# EAGLE board zx80 SD_12 (smd) build002-001 (EAGLE 9.6.2), part 1 of 2
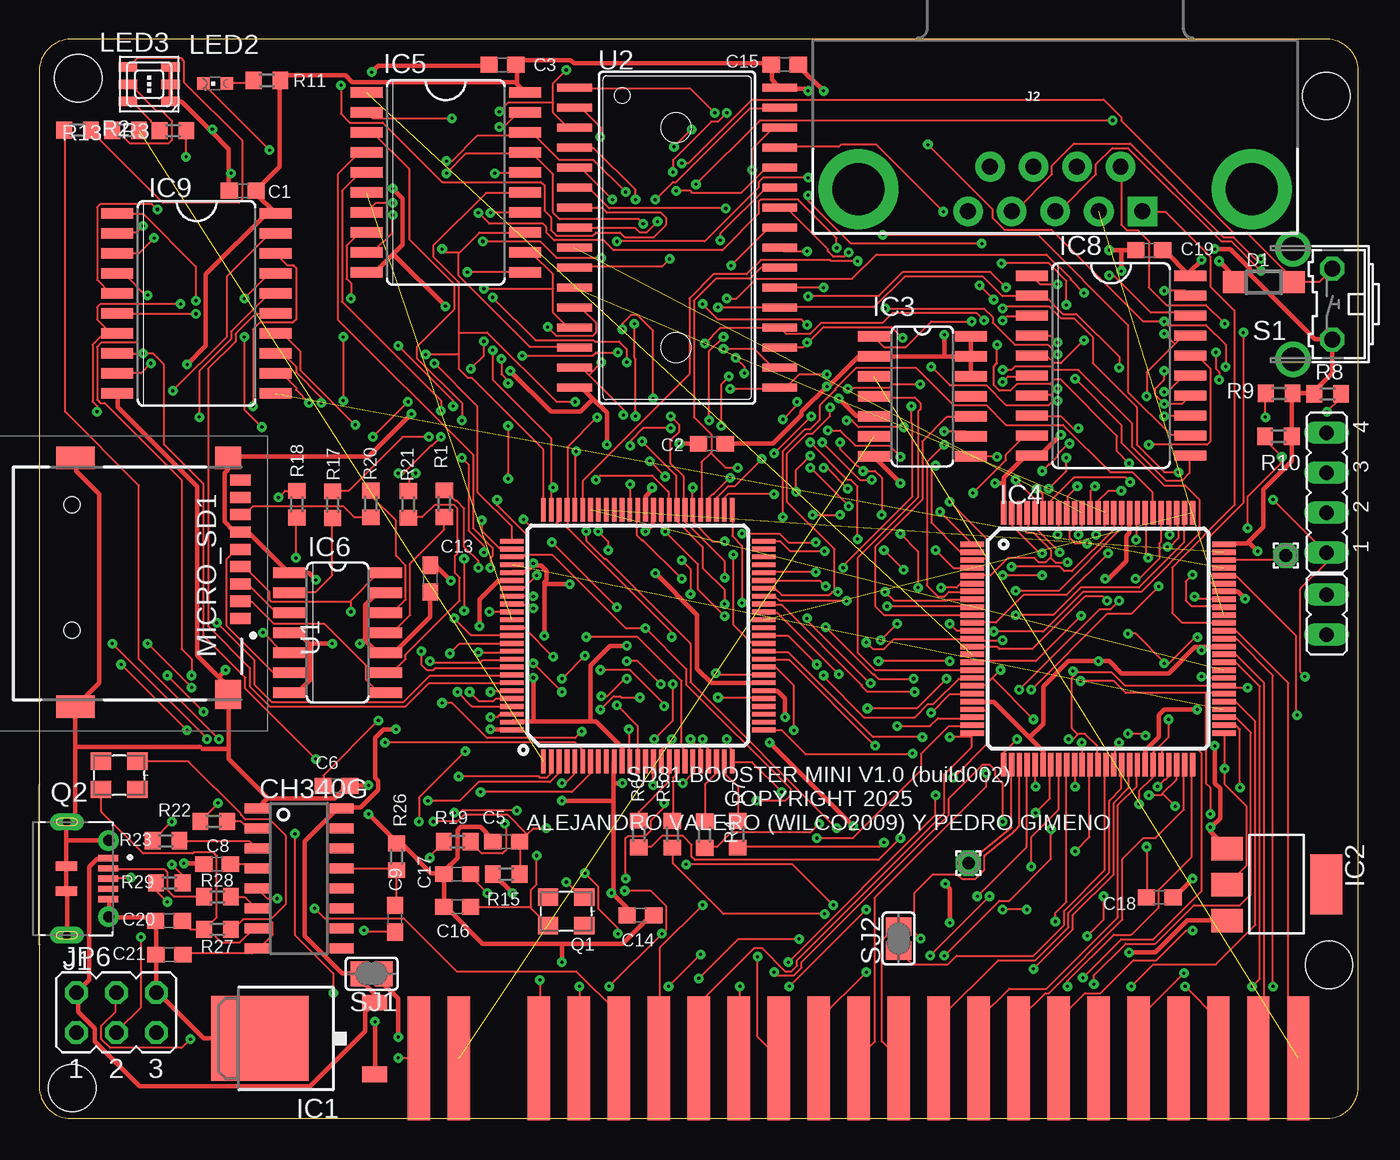
[diagram p2: board, top side]
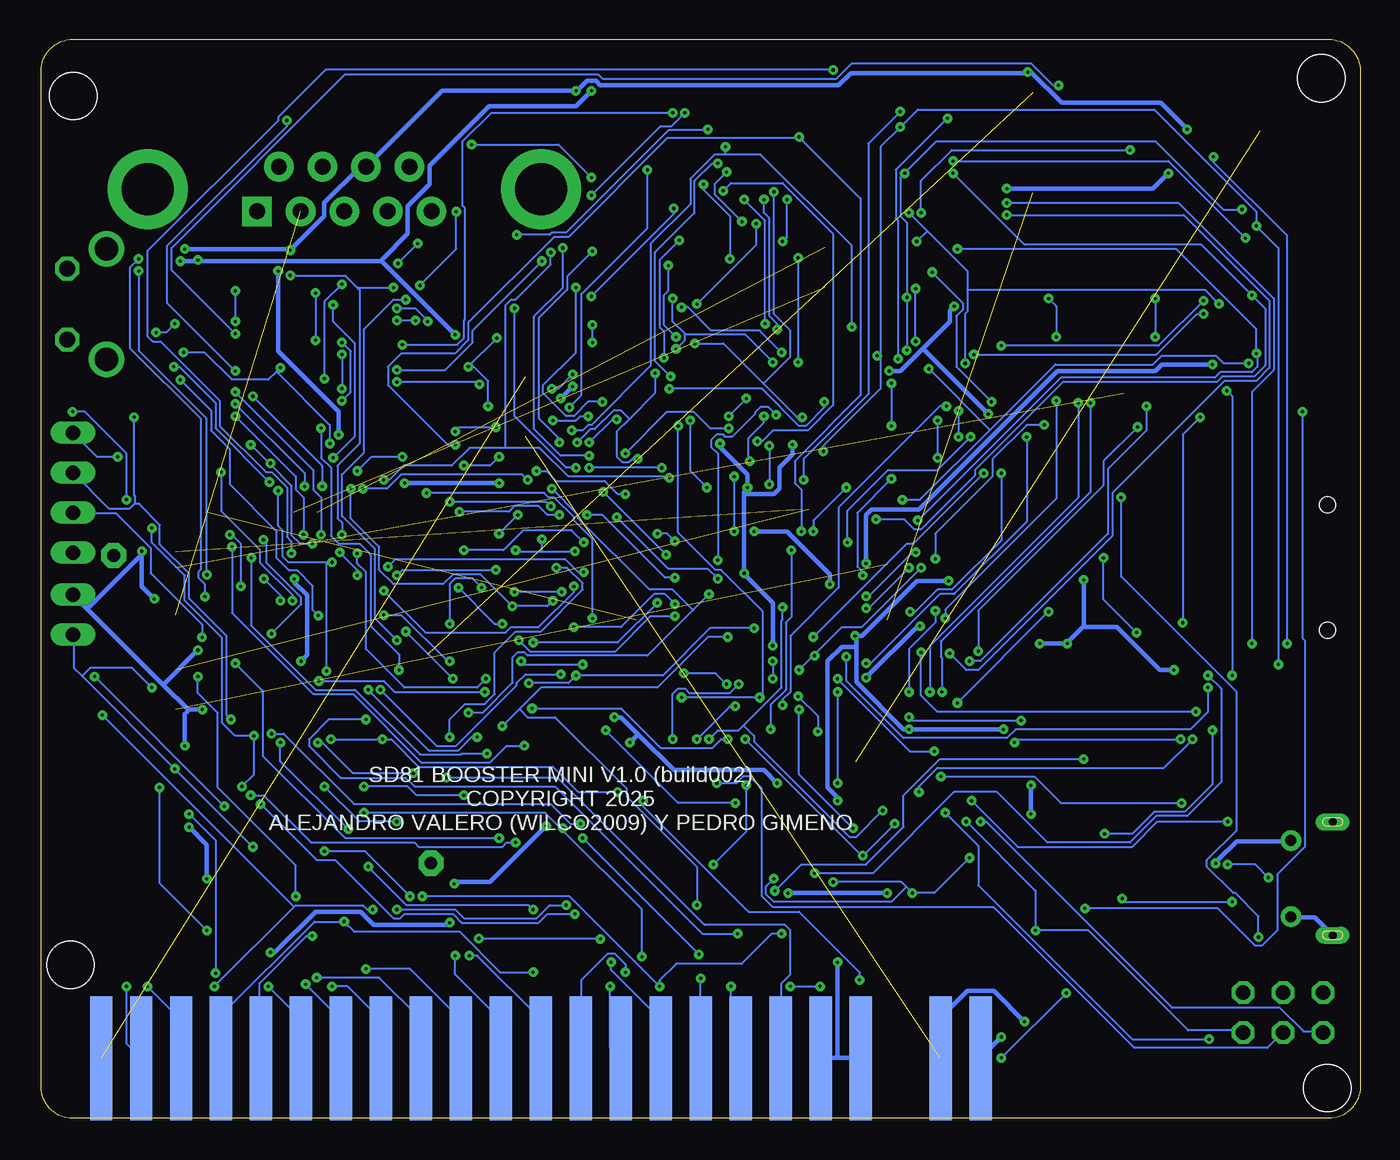
[diagram p3: board, bottom side, seen from below]

Size 83.82 x 68.58 mm. Coordinates in mm from the lower left corner, seen from the top.
Outline: 2,0 81.82,0 arc90 83.82,2 83.82,66.58 arc90 81.82,68.58 2,68.58 arc90 0,66.58 0,2 arc90 2,0
Copper layers (1*16): Top 0.035mm / dielectric 1.5mm / Bottom 0.035mm
Design rules "default *": minimum track width 5mil, minimum drill 0.2mm, track to track 6mil, track to pad 6mil, pad to pad 6mil, via to via 6mil, smd to smd 6mil, copper to edge 40mil, drill to drill 6mil, minimum pad ring 10mil, minimum via ring 8mil, stop-mask expansion 4mil, vias tented up to drill 999mil, thermal gap 10mil
Net classes: 1 VCC: width 0.3 mm; 2 3,3: width 0.3 mm
Holes 3 mm at 2.09,1.93 2.46,66.1 81.79,64.98 81.96,9.75

## Footprints (pad centres in the part's own frame; a part is rotated, then mirrored left to right if it is on the bottom)
EDGEPIN = smd 1.422 x 7.874: 1 0,0
C0603 = smd 1.1 x 1: 1 -0.85,0; 2 0.85,0
SOD123 = smd 1.4 x 1.4: A 1.9,0; C -1.9,0
TO252 = smd 1 x 1.6: 1 -2.28,-4.8; 2 2.28,-4.8 | smd 5.4 x 6.2: 3 0,2.5
SOT223 = smd 1.499 x 2.007: 1 -2.261,-3.15; 2 0.025,-3.15; 3 2.311,-3.15 | smd 3.81 x 2.007: 4 0,3.15
SO14 = smd 0.66 x 2.032: 1 -3.81,-3.073; 2 -2.54,-3.073; 3 -1.27,-3.073; 4 0,-3.073; 5 1.27,-3.073; 6 2.54,-3.073; 7 3.81,-3.073; 8 3.81,3.073; 9 2.54,3.073; 10 1.27,3.073; 11 0,3.073; 12 -1.27,3.073; 13 -2.54,3.073; 14 -3.81,3.073
TQFP100 = smd 1.5 x 0.345: 1 -8,6; 2 -8,5.5; 3 -8,5; 4 -8,4.5; 5 -8,4; 6 -8,3.5; 7 -8,3; 8 -8,2.5; 9 -8,2; 10 -8,1.5; 11 -8,1; 12 -8,0.5; 13 -8,0; 14 -8,-0.5; 15 -8,-1; 16 -8,-1.5; 17 -8,-2; 18 -8,-2.5; 19 -8,-3; 20 -8,-3.5; 21 -8,-4; 22 -8,-4.5; 23 -8,-5; 24 -8,-5.5; 25 -8,-6; 51 8,-6; 52 8,-5.5; 53 8,-5; 54 8,-4.5; 55 8,-4; 56 8,-3.5; 57 8,-3; 58 8,-2.5; 59 8,-2; 60 8,-1.5; 61 8,-1; 62 8,-0.5; 63 8,0; 64 8,0.5; 65 8,1; 66 8,1.5; 67 8,2; 68 8,2.5; 69 8,3; 70 8,3.5; 71 8,4; 72 8,4.5; 73 8,5; 74 8,5.5; 75 8,6 | smd 0.345 x 1.5: 26 -6,-8; 27 -5.5,-8; 28 -5,-8; 29 -4.5,-8; 30 -4,-8; 31 -3.5,-8; 32 -3,-8; 33 -2.5,-8; 34 -2,-8; 35 -1.5,-8; 36 -1,-8; 37 -0.5,-8; 38 0,-8; 39 0.5,-8; 40 1,-8; 41 1.5,-8; 42 2,-8; 43 2.5,-8; 44 3,-8; 45 3.5,-8; 46 4,-8; 47 4.5,-8; 48 5,-8; 49 5.5,-8; 50 6,-8; 76 6,8; 77 5.5,8; 78 5,8; 79 4.5,8; 80 4,8; 81 3.5,8; 82 3,8; 83 2.5,8; 84 2,8; 85 1.5,8; 86 1,8; 87 0.5,8; 88 0,8; 89 -0.5,8; 90 -1,8; 91 -1.5,8; 92 -2,8; 93 -2.5,8; 94 -3,8; 95 -3.5,8; 96 -4,8; 97 -4.5,8; 98 -5,8; 99 -5.5,8; 100 -6,8
SO20W = smd 0.66 x 2.032: 1 -5.715,-5.029; 2 -4.445,-5.029; 3 -3.175,-5.029; 4 -1.905,-5.029; 5 -0.635,-5.029; 6 0.635,-5.029; 7 1.905,-5.029; 8 3.175,-5.029; 9 4.445,-5.029; 10 5.715,-5.029; 11 5.715,5.029; 12 4.445,5.029; 13 3.175,5.029; 14 1.905,5.029; 15 0.635,5.029; 16 -0.635,5.029; 17 -1.905,5.029; 18 -3.175,5.029; 19 -4.445,5.029; 20 -5.715,5.029
SOIC16 = smd 0.635 x 1.524: 1 -4.445,-2.695; 2 -3.175,-2.695; 3 -1.905,-2.695; 4 -0.635,-2.695; 5 0.635,-2.695; 6 1.905,-2.695; 7 3.175,-2.695; 8 4.445,-2.695; 9 4.445,2.695; 10 3.175,2.695; 11 1.905,2.695; 12 0.635,2.695; 13 -0.635,2.695; 14 -1.905,2.695; 15 -3.175,2.695; 16 -4.445,2.695
SHOUHAN_MICROXNJ = smd 0.4 x 1.25: 1 1.3,-4.375; 2 0.65,-4.375; 3 0,-4.375; 4 -0.65,-4.375; 5 -1.3,-4.375 | smd 0.6 x 1.35: S1 -0.8,-1.725; S2 0.8,-1.725 | drill 0.5 pad 1.07 long: S3 -3.6,-1.75; S6 3.6,-1.75 | drill 0.7 pad 1.3: S4 -2.425,-4.4; S5 2.425,-4.4
DB9_MALE = drill 1.016 pad 1.88 square: 1 5.54,-1.42 | drill 1.016 pad 1.88: 2 2.77,-1.42; 3 0,-1.42; 4 -2.77,-1.42; 5 -5.54,-1.42; 6 4.15,1.42; 7 1.38,1.42; 8 -1.38,1.42; 9 -4.15,1.42 | drill 3.302 pad 5.08: G1 -12.5,0; G2 12.5,0
JP1 = drill 0.914 long: 1 0,-1.27; 2 0,1.27
JP4 = drill 0.914 long: 1 -3.81,0; 2 -1.27,0; 3 1.27,0; 4 3.81,0
JP3Q = drill 0.914 octagon: 1 -2.54,-1.27; 2 -2.54,1.27; 3 0,-1.27; 4 0,1.27; 5 2.54,-1.27; 6 2.54,1.27
CHIPLED_0603 = smd 0.8 x 0.8: A 0,-0.75; C 0,0.75
3535-PLCC6 = smd 1.2 x 0.6: P1 1.35,-1.1; P2 1.35,0; P3 1.35,1.1; P4 -1.35,1.1; P5 -1.35,0; P6 -1.35,-1.1
TF-01A = smd 0.7 x 1.3: 1 2.23,7.174; 2 1.13,7.174; 3 0.03,7.174; 4 -1.07,7.174; 5 -2.17,7.174; 6 -3.27,7.174; 7 -4.37,7.174; 8 -5.47,7.174; CD1 -6.57,7.174 | smd 1.448 x 1.651: MP1 -7.989,6.4 | smd 1.448 x 2.438: MP2 -7.989,-3.3; MP3 7.836,-3.3 | smd 1.854 x 1.651: MP4 7.061,6.4 | hole 1: -5.004,-3.531; 2.972,-3.531
1,6/0,8 = drill 0.813 pad 1.6 octagon: 1 0,0
3.2X2.5_KX-7 = smd 1.3 x 1.1: 1 -1.15,-0.9; 2 1.15,-0.9; 3 1.15,0.9; 4 -1.15,0.9
R0603 = smd 1 x 1.1: 1 -0.85,0; 2 0.85,0
B3F-31XX = drill 1.016 octagon: 1 -2.261,-1.245; 2 2.261,-1.245 | drill 1.499 pad 2.159: 3 -3.505,1.245; 4 3.505,1.245
SJ = smd 1.168 x 1.6: 1 -0.762,0; 2 0.762,0
TQFP100' = smd 1.5 x 0.3: 1 -8,6; 2 -8,5.5; 3 -8,5; 4 -8,4.5; 5 -8,4; 6 -8,3.5; 7 -8,3; 8 -8,2.5; 9 -8,2; 10 -8,1.5; 11 -8,1; 12 -8,0.5; 13 -8,0; 14 -8,-0.5; 15 -8,-1; 16 -8,-1.5; 17 -8,-2; 18 -8,-2.5; 19 -8,-3; 20 -8,-3.5; 21 -8,-4; 22 -8,-4.5; 23 -8,-5; 24 -8,-5.5; 25 -8,-6; 51 8,-6; 52 8,-5.5; 53 8,-5; 54 8,-4.5; 55 8,-4; 56 8,-3.5; 57 8,-3; 58 8,-2.5; 59 8,-2; 60 8,-1.5; 61 8,-1; 62 8,-0.5; 63 8,0; 64 8,0.5; 65 8,1; 66 8,1.5; 67 8,2; 68 8,2.5; 69 8,3; 70 8,3.5; 71 8,4; 72 8,4.5; 73 8,5; 74 8,5.5; 75 8,6 | smd 0.3 x 1.5: 26 -6,-8; 27 -5.5,-8; 28 -5,-8; 29 -4.5,-8; 30 -4,-8; 31 -3.5,-8; 32 -3,-8; 33 -2.5,-8; 34 -2,-8; 35 -1.5,-8; 36 -1,-8; 37 -0.5,-8; 38 0,-8; 39 0.5,-8; 40 1,-8; 41 1.5,-8; 42 2,-8; 43 2.5,-8; 44 3,-8; 45 3.5,-8; 46 4,-8; 47 4.5,-8; 48 5,-8; 49 5.5,-8; 50 6,-8; 76 6,8; 77 5.5,8; 78 5,8; 79 4.5,8; 80 4,8; 81 3.5,8; 82 3,8; 83 2.5,8; 84 2,8; 85 1.5,8; 86 1,8; 87 0.5,8; 88 0,8; 89 -0.5,8; 90 -1,8; 91 -1.5,8; 92 -2,8; 93 -2.5,8; 94 -3,8; 95 -3.5,8; 96 -4,8; 97 -4.5,8; 98 -5,8; 99 -5.5,8; 100 -6,8
SOP32-5 = smd 2.2 x 0.5: 1 -6.516,9.525; 2 -6.516,8.255; 3 -6.516,6.985; 4 -6.516,5.715; 5 -6.516,4.445; 6 -6.516,3.175; 7 -6.516,1.905; 8 -6.516,0.635; 9 -6.516,-0.635; 10 -6.516,-1.905; 11 -6.516,-3.175; 12 -6.516,-4.445; 13 -6.516,-5.715; 14 -6.516,-6.985; 15 -6.516,-8.255; 16 -6.516,-9.525; 17 6.516,-9.525; 18 6.516,-8.255; 19 6.516,-6.985; 20 6.516,-5.715; 21 6.516,-4.445; 22 6.516,-3.175; 23 6.516,-1.905; 24 6.516,-0.635; 25 6.516,0.635; 26 6.516,1.905; 27 6.516,3.175; 28 6.516,4.445; 29 6.516,5.715; 30 6.516,6.985; 31 6.516,8.255; 32 6.516,9.525

## Placement (x,y rotation side)
1A  D7  [EDGEPIN]  24.13,3.81 0 top
1B  VCC  [EDGEPIN]  24.13,3.81 180 bottom
2A  /RAMCS  [EDGEPIN]  26.67,3.81 0 top
2B  9V  [EDGEPIN]  26.67,3.81 180 bottom
4A  D0  [EDGEPIN]  31.75,3.81 0 top
4B  GND  [EDGEPIN]  31.75,3.81 180 bottom
5A  D1  [EDGEPIN]  34.29,3.81 0 top
5B  GND  [EDGEPIN]  34.29,3.81 180 bottom
6A  D2  [EDGEPIN]  36.83,3.81 0 top
6B  /CLOCK  [EDGEPIN]  36.83,3.81 180 bottom
7A  D6  [EDGEPIN]  39.37,3.81 0 top
7B  A0  [EDGEPIN]  39.37,3.81 180 bottom
8A  D5  [EDGEPIN]  41.91,3.81 0 top
8B  A1  [EDGEPIN]  41.91,3.81 180 bottom
9A  D3  [EDGEPIN]  44.45,3.81 0 top
9B  A2  [EDGEPIN]  44.45,3.81 180 bottom
10A  D4  [EDGEPIN]  46.99,3.81 0 top
10B  A3  [EDGEPIN]  46.99,3.81 180 bottom
11A  A6  [EDGEPIN]  49.53,3.81 0 top
11B  A15  [EDGEPIN]  49.53,3.81 180 bottom
12A  /NMI  [EDGEPIN]  52.07,3.81 0 top
12B  A14  [EDGEPIN]  52.07,3.81 180 bottom
13A  /HALT  [EDGEPIN]  54.61,3.81 0 top
13B  A13  [EDGEPIN]  54.61,3.81 180 bottom
14A  /MREQ  [EDGEPIN]  57.15,3.81 0 top
14B  A12  [EDGEPIN]  57.15,3.81 180 bottom
15A  /IORQ  [EDGEPIN]  59.69,3.81 0 top
15B  A11  [EDGEPIN]  59.69,3.81 180 bottom
16A  /RD  [EDGEPIN]  62.23,3.81 0 top
16B  A10  [EDGEPIN]  62.23,3.81 180 bottom
17A  /WR  [EDGEPIN]  64.77,3.81 0 top
17B  A9  [EDGEPIN]  64.77,3.81 180 bottom
18A  /BUSAK  [EDGEPIN]  67.31,3.81 0 top
18B  A8  [EDGEPIN]  67.31,3.81 180 bottom
19A  /WAIT  [EDGEPIN]  69.85,3.81 0 top
19B  A7  [EDGEPIN]  69.85,3.81 180 bottom
20A  /BUSRQ  [EDGEPIN]  72.39,3.81 0 top
20B  A6  [EDGEPIN]  72.39,3.81 180 bottom
21A  /RESET  [EDGEPIN]  74.93,3.81 0 top
21B  A5  [EDGEPIN]  74.93,3.81 180 bottom
22A  /M1  [EDGEPIN]  77.47,3.81 0 top
22B  A4  [EDGEPIN]  77.47,3.81 180 bottom
23A  /RFSH  [EDGEPIN]  80.01,3.81 0 top
23B  /ROMCS  [EDGEPIN]  80.01,3.81 180 bottom
C1  100nF  [C0603]  12.93,58.96 180 top
C2  100nF  [C0603]  42.74,42.88 180 top
C3  100nF  [C0603]  29.43,66.96 180 top
C5  22pF  [C0603]  29.67,17.58 0 top
C6  0.1uF  [C0603]  18.89,21.13 0 top
C8  0.1uF  [C0603]  11.3,16.16 0 top
C9  100nF  [C0603]  22.61,12.69 90 top
C13  0.1uF  [C0603]  24.85,34.3 270 top
C14  0.1uF  [C0603]  38.2,12.9 0 top
C15  100nF  [C0603]  47.37,66.97 0 top
C16  22pF  [C0603]  26.56,13.44 0 top
C17  22pF  [C0603]  26.55,15.53 0 top
C18  100nF  [C0603]  71.2,14.04 0 top
C19  100nF  [C0603]  70.54,55.18 180 top
C20  22pF  [C0603]  8.24,12.56 0 top
C21  22pF  [C0603]  8.27,10.41 0 top
D1  [SOD123]  77.81,53.14 0 top
IC1  7805DT  [TO252]  16.51,5.08 90 top
IC2  REG1117  [SOT223]  78.64,14.89 270 top
IC3  74ACT125D  [SO14]  56.12,45.89 270 top
IC4  XC95144XL-10TQG100C  [TQFP100]  67.28,30.49 0 top
IC5  74HC573D  [SO20W]  25.83,59.48 270 top
IC6  74LVC125  [SO14]  18.96,30.87 270 top
IC7  CH340G  [SOIC16]  16.51,15.24 270 top
IC8  74HC573D  [SO20W]  68.11,47.84 270 top
IC9  74HC573D  [SO20W]  9.99,51.79 270 top
J1  MICROXNJ (C404969)  [SHOUHAN_MICROXNJ]  0,15.24 90 top
J2  JOYSTICK  [DB9_MALE]  64.57,59.07 0 top
JP2  [JP1]  81.81,32.02 0 top
JP3  JTAG  [JP4]  81.81,39.76 90 top
JP6  ICSP  [JP3Q]  4.89,6.73 0 top
LED2  SD  [CHIPLED_0603]  11.18,65.77 90 top
LED3  RS-3535MWAR  [3535-PLCC6]  6.98,65.73 0 top
MICRO_SD1  TF-01A  [TF-01A]  5.6,34 270 top
PAD1  [1,6/0,8]  59.05,16.22 0 top
PAD6  P73  [1,6/0,8]  79.22,35.78 0 top
Q1  16MHz  [3.2X2.5_KX-7]  33.48,13.16 180 top
Q2  12MHz  [3.2X2.5_KX-7]  5.08,21.81 180 top
R1  0R  [R0603]  25.74,39.07 270 top
R2  150  [R0603]  2.44,62.8 0 top
R3  68  [R0603]  8.51,62.78 180 top
R4  180  [R0603]  42.28,18.04 270 top
R5  180  [R0603]  40.23,18.06 270 top
R6  100  [R0603]  38.1,18.08 270 top
R7  180  [R0603]  44.39,18.05 270 top
R8  330  [R0603]  81.87,46.04 0 top
R9  330  [R0603]  78.8,46.07 180 top
R10  330  [R0603]  78.74,43.35 180 top
R11  680  [R0603]  14.47,65.97 180 top
R13  150  [R0603]  5.48,62.78 180 top
R15  [R0603]  29.67,15.53 180 top
R17  3k3  [R0603]  18.65,39.01 270 top
R18  3k3  [R0603]  16.37,39.04 270 top
R19  1M  [R0603]  26.56,17.59 0 top
R20  3k3  [R0603]  21.07,39.05 270 top
R21  3k3  [R0603]  23.45,39.02 270 top
R22  1K  [R0603]  11.08,18.87 0 top
R23  1K  [R0603]  8.05,17.64 0 top
R26  1K  [R0603]  22.7,16.63 90 top
R27  1M  [R0603]  11.33,12.01 180 top
R28  22R  [R0603]  11.33,14.09 180 top
R29  22R  [R0603]  8.26,14.97 0 top
S1  RESET  [B3F-31XX]  80.93,51.76 90 top
SJ1  POWER_5V  [SJ]  21.12,9.19 180 top
SJ2  MC45  [SJ]  54.61,11.43 90 top
U1  ATMEGA2560AU  [TQFP100']  38.03,30.69 90 top
U2  AS6C4008-55SINSOP5  [SOP32-5]  40.53,55.97 0 top

## Tracks (layer width: path | path; a pad name or v marks a point on that pad's centre or on a via)
3V3  (via drill 0.2)
  Top 0.127: IC4.51 75.33,24.45 v75.33,22.21 75.33,21.23 76.73,19.84 76.73,16.07 75.54,14.88 IC2.2 | v70.37,17.25 70.37,14.04 C18.1 | 64.26,35.66 64.29,35.69 64.29,36.11 63.18,37.23 62.76,37.23 62.34,37.65 62.34,38.49 IC4.98 | 64.26,35.66 63.94,35.34 63.53,35.34 63.25,35.62 61.57,35.62 60.45,34.51 59.33,34.51 IC4.5 | v68.76,39.88 67.93,39.88 67.3,39.26 67.3,38.56 IC4.88 | v65.34,35.34 64.57,35.34 64.26,35.66 | 19.76,32.86 21.55,34.65 21.97,34.65 IC6.14 | 19.76,32.86 19.73,32.83 14.77,32.83 14.63,32.97 14.63,33.46 13.02,35.06 12.81,35.06 MICRO_SD1.4 | v62.13,24.1 61.29,23.26 IC4.26 | v65.41,24.1 65.69,24.1 66,24.41 | 66,24.41 66.04,24.45 66.46,24.45 67.23,23.68 67.23,22.49 IC4.38 | v47.18,20.75 45.3,22.63 44.04,22.63 U1.25 43.97,22.7 43.97,23.47 43.69,23.75 v43.69,24.1 | 65.86,28.25 65.62,28.01 65.62,24.8 66,24.41 | 65.86,28.25 65.97,28.36 68.14,28.36 68.97,27.52 75.26,27.52 IC4.57 75.33,27.45 75.4,27.38 v76.8,27.38 | v19.8,32.2 19.8,32.83 19.76,32.86 | v25.6,26.4 26.23,26.4 28.46,24.17 34.05,24.17 v34.47,24.59 | v35.72,26.82 36.07,26.82 37.19,27.94 v37.33,27.94 | v37.33,29.06 38.03,29.06 v39.5,27.59 | 65.86,28.25 v65.69,28.43
  Bottom 0.127: 81.23,28.11 81.76,28.64 81.76,30.73 JP2.1 | 81.23,28.11 v75.33,22.21 v70.37,17.25 | v68.76,39.88 68.76,37.65 68.48,37.37 68.48,35.72 68.11,35.34 65.69,35.34 | v65.34,35.34 65.69,35.34 | v65.41,24.1 v62.13,24.1 61.57,24.1 59.82,22.35 51.3,22.35 49.69,20.75 v47.18,20.75 | v25.6,26.4 v19.8,32.2 | v34.47,24.59 34.47,25.57 v35.72,26.82 | v37.33,29.06 v37.33,27.94 | v39.5,27.59 40.06,27.03 42.64,27.03 42.92,27.31 43.34,27.31 43.69,26.96 v43.69,24.1 | v65.69,28.43 65.69,35.34 | 81.23,28.11 80.71,28.64 78.05,28.64 v76.8,27.38
5V  (via drill 0.2)
  Top 0.3: v22.8,5.17 22.8,7.61 21.9,8.52 21.9,9.15 SJ1.1
  Bottom 0.3: v22.8,5.17 24.13,3.84 1B.1
9V  (via drill 0.2)
  Top 0.3: v21.34,6.15 21.34,2.86 IC1.1
  Bottom 0.3: v21.34,6.15 23.29,8.1 24.97,8.1 26.65,6.43 26.65,3.84 2B.1
74573_OC  (via drill 0.2)
  Top 0.127: v40.19,24.1 39.57,23.47 39.57,22.7 U1.16 | v52.63,26.05 55.77,26.05 v57.66,27.94 | v60.66,30.94 63.81,30.94 66.32,33.46 70.02,33.46 73.72,37.16 73.72,39.33 72.81,40.23 71.49,40.23 68.76,42.96 68.76,44.08 v65.83,47.01 | v64.71,53.02 63.59,53.02 63.11,53.51 IC8.1
  Bottom 0.127: v40.19,24.1 40.61,24.1 41.17,23.54 44.46,23.54 46.97,26.05 v52.63,26.05 | v60.66,30.94 v57.66,27.94 | v65.83,47.01 65.83,51.9 v64.71,53.02
/CLOCK  (via drill 0.2)
  Top 0.127: v58.08,21.65 60.31,23.89 60.31,25.7 60.03,25.98 59.33,25.98 IC4.22
  Bottom 0.127: v58.08,21.65 51.02,21.65 41.66,12.29 36.56,12.29 36.21,11.94 36.21,9.15 36.77,8.59 36.77,3.84 6B.1
/HALT
  Top 0.127: SJ2.2 54.58,12.15 54.38,12.15 53.54,11.32 53.54,4.89 54.58,3.84 13A.1
/IORQ
  Top 0.127: IC4.43 69.74,22.42 69.74,21.09 68.56,19.91 68.56,12.78 64.01,8.24 61.64,8.24 59.75,6.36 59.75,3.84 15A.1
/M1
  Top 0.127: IC4.61 75.33,29.48 76.03,29.48 77.84,27.66 77.84,4.19 77.5,3.84 22A.1
/MEM_CE  (via drill 0.2)
  Top 0.127: v49.91,36.04 47.74,36.04 47.11,36.67 46.06,36.67 U1.50 | v54.93,34.85 v53.68,36.11 | v63.73,34.51 v61.22,34.51 | v64.85,35.97 63.32,37.51 62.97,37.51 62.83,37.65 62.83,38.49 IC4.97 | v49.83,52.81 47.11,52.81 U2.22 | v48.16,45.54 48.16,45.33 v47.25,44.42 | v49,42.96 51.37,40.58 51.58,40.58 52,40.16 v52,36.81
  Bottom 0.127: 52,36.04 53.61,36.04 v53.68,36.11 | 52,36.04 v49.91,36.04 | v54.93,34.85 60.87,34.85 v61.22,34.51 | v63.73,34.51 63.73,34.85 v64.85,35.97 | v49.83,52.81 49.83,48.69 51.93,46.59 51.93,46.1 50.46,44.63 49.97,44.63 49.07,45.54 v48.16,45.54 | v47.25,44.42 47.53,44.42 v49,42.96 | 52,36.04 v52,36.81
/MEM_OE  (via drill 0.2)
  Top 0.127: v46.69,39.67 43.76,39.67 43.55,39.47 43.55,38.7 U1.52 | v50.88,42.96 50.88,42.54 51.93,41.49 52,41.49 v52.35,41.14 53.12,41.14 53.54,40.72 v53.54,38.35 | v48.79,55.11 47.32,55.11 47.11,55.32 U2.24 | v57.87,31.43 58.29,31.01 59.27,31.01 IC4.12 | v55.84,33.74 55.84,36.04 v54.72,37.16
  Bottom 0.127: v46.69,39.67 47.18,39.67 48.02,40.51 51.09,40.51 51.72,41.14 v52.35,41.14 | v50.88,42.96 50.88,43.17 52.21,44.49 52.21,50.85 50.39,52.67 50.39,53.51 v48.79,55.11 | v57.87,31.43 57.87,33.95 57.52,34.3 56.4,34.3 v55.84,33.74 | v53.54,38.35 v54.72,37.16
/MREQ
  Top 0.127: IC4.41 68.76,22.42 68.76,20.95 68,20.19 68,15.65 65.41,13.06 65.41,12.15 63.32,10.06 60.94,10.06 57.17,6.29 57.17,3.84 14A.1
/NMI  (via drill 0.2)
  Top 0.127: v66.25,23.89 66.25,22.49 IC4.36 | v60.17,21.93 60.17,21.09 53.12,14.04 53.12,4.89 52.07,3.84 12A.1
  Bottom 0.127: v66.25,23.89 65.97,23.89 64.01,21.93 v60.17,21.93
/OE_CTRL_CLOCK
  Top 0.127: IC4.10 59.27,31.99 53.68,31.99 53.12,32.55 53.12,36.32 56.12,39.33 56.12,43.03 57.66,44.56 59.12,44.56 IC3.10
/OE_IL  (1 unrouted)
/OE_RAMCS
  Top 0.127: IC4.17 59.27,28.5 53.12,28.5 52,29.62 52,35.62 55.84,39.47 55.84,44.91 55.98,45.05 55.98,45.47 55.63,45.82 53.05,45.82 IC3.4
/OE_ROMCS  (via drill 0.2)
  Top 0.127: v67.86,32.9 67.59,33.16 66.44,33.16 63.11,29.83 61.01,29.83 60.87,29.97 59.33,29.97 IC4.14 | v72.4,41.07 71.49,41.07 69.74,42.82 69.74,45.19 66.95,47.99 66.95,49.66 65.76,50.85 64.92,50.85 64.15,51.62 61.36,51.62 v61.22,51.48 | v59.27,50.64 56.68,50.64 55.07,49.03 53.68,49.03 53.05,49.66 IC3.1
  Bottom 0.127: v67.86,32.9 67.86,33.25 69.93,35.32 69.93,36.15 72.4,38.61 v72.4,41.07 | v61.22,51.48 60.03,51.48 59.27,50.71 v59.27,50.64
/RAMCS  (1 unrouted)
/RD
  Top 0.127: IC4.49 72.75,22.42 72.75,19.63 70.93,17.81 70.16,17.81 68.83,16.48 68.83,12.64 64.15,7.96 63.94,7.96 62.27,6.29 62.27,3.84 16A.1
/RESET  (via drill 0.2)
  Top 0.127: v39.01,21.16 39.01,22.63 U1.15 | v41.1,16.14 47.88,16.14 v50.46,13.55 | v62.76,13.27 v61.22,13.27 | v72.81,8.38 74.91,6.29 74.91,3.84 21A.1 | v79.94,25.64 79.87,25.7 79.87,30.66 76.1,34.44 75.33,34.44 IC4.71
  Bottom 0.127: v39.01,21.16 39.01,18.23 v41.1,16.14 | v50.46,13.55 51.51,13.55 52.35,12.71 56.96,12.71 57.52,13.27 v61.22,13.27 | v62.76,13.27 63.11,13.27 63.39,13.55 67.65,13.55 67.75,13.45 | v72.81,8.38 67.75,13.45 | 67.75,13.45 v79.94,25.64
/RFSH
  Top 0.127: IC4.64 75.33,30.94 76.1,30.94 79.38,27.66 79.38,4.47 80.01,3.84 23A.1
/ROMCS  (1 unrouted)
/WAIT  (via drill 0.2)
  Top 0.127: v55.63,27.1 52.63,27.1 52.28,27.45 52.28,27.52 47.18,32.62 46.06,32.62 U1.42 | v66.18,27.8 68.28,27.8 69.04,27.03 74.14,27.03 | 74.14,27.03 75.26,27.03 IC4.56 | v72.75,9.22 69.88,6.36 69.88,3.84 19A.1 | v74.42,19.35 74.42,21.02 74.14,21.3 74.14,27.03
  Bottom 0.127: v55.63,27.1 61.36,27.1 62.06,27.8 v66.18,27.8 | v72.75,9.22 72.75,17.67 v74.42,19.35
/WR  (via drill 0.2)
  Top 0.127: v76.31,21.02 76.31,24.73 76.1,24.94 75.33,24.94 IC4.52 | v73.3,11.94 72.89,11.94 71,10.06 69.53,10.06 67.44,7.96 66.46,7.96 64.78,6.29 64.78,3.84 17A.1
  Bottom 0.127: v76.31,21.02 76.31,14.95 v73.3,11.94
/WR'  (via drill 0.2)
  Top 0.127: v52.56,30.25 52.98,29.83 53.68,29.83 54.31,30.45 59.27,30.45 IC4.13 59.33,30.45 59.4,30.39 v61.22,30.39 | v44.67,32.76 44.67,36.39 44.04,37.02 44.04,38.63 U1.51 | v57.45,57.63 53.19,61.89 50.95,61.89 50.81,61.75 47.11,61.75 U2.29 | v60.66,52.04 v59.75,52.95
  Bottom 0.127: v52.56,30.25 47.18,30.25 v44.67,32.76 | v57.45,57.63 57.45,55.25 v59.75,52.95 | v60.66,52.04 61.43,52.04 63.32,50.15 63.32,42.33 64.71,40.93 64.71,38.28 62.62,36.18 62.62,31.78 v61.22,30.39
A0  (via drill 0.2)
  Top 0.127: v49.42,17.81 51.72,17.81 56.05,22.14 56.05,23.19 57.8,24.94 59.27,24.94 IC4.24 | v39.99,8.38 v42.02,10.42
  Bottom 0.127: v42.02,10.42 v49.42,17.81 | v39.99,8.38 39.99,4.4 39.43,3.84 7B.1
A0'  (via drill 0.2)
  Top 0.127: v56.96,41.49 56.68,41.21 56.68,37.86 58.5,36.04 59.27,36.04 IC4.2 | v54.72,42.05 54.03,42.75 51.86,42.75 50.88,43.73 v50.11,43.73 | v32.3,50.29 32.86,49.73 35.17,49.73 35.38,49.94 35.38,50.57 34.47,51.48 34.05,51.48 U2.12 | v53.61,56.16 63.46,56.16 69.18,50.43 69.18,46.17 71.91,43.45 73.09,43.45 IC8.12 | v40.33,61.75 v41.45,62.87
  Bottom 0.127: v56.96,41.49 55.28,41.49 v54.72,42.05 | v50.11,43.73 49.42,43.73 49.07,44.08 48.86,44.08 45.08,47.85 45.08,55.6 42.57,58.12 42.57,59.72 41.03,61.26 40.33,61.26 | 40.33,61.26 38.1,61.26 32.3,55.46 v32.3,50.29 | v53.61,56.16 51.51,56.16 51.37,56.3 50.46,56.3 43.97,62.8 41.52,62.8 v41.45,62.87 | 40.33,61.26 v40.33,61.75
A1  (via drill 0.2)
  Top 0.127: v41.91,8.89 44.43,11.41 v48.28,11.41 | v56.01,11.43 55.63,11.82 55.63,14.34 56.81,15.52 58.32,15.52 58.63,15.21 59.47,15.21 60.07,15.8 60.07,16.64 60.04,16.67 61.88,18.19 61.89,18.19 61.97,18.26 62.05,18.33 62.05,18.34 62.28,18.58 IC4.28
  Bottom 0.127: 8B.1 v41.91,8.89 | v48.28,11.41 55.99,11.41 v56.01,11.43
A1'  (via drill 0.2)  (1 unrouted)
  Top 0.127: v67.16,37.09 67.72,37.65 67.72,38.49 IC4.87 | v71.49,44.63 73.09,44.63 IC8.13
  Bottom 0.127: v67.16,37.09 67.16,39.47 67.65,39.95 67.65,40.79 v71.49,44.63
A2  (via drill 0.2)
  Top 0.127: v63.32,21.09 63.32,22.42 IC4.30 | v56.96,20.54 56.96,19.28 v47.6,9.92
  Bottom 0.127: v63.32,21.09 60.52,21.09 59.96,20.54 v56.96,20.54 | v47.6,9.92 47.6,9.43 44.46,6.29 44.46,3.84 9B.1
A2'  (via drill 0.2)
  Top 0.127: v67.09,40.16 66.81,39.88 66.81,38.56 IC4.89 | IC8.14 73.09,45.89 72.61,45.4 v71.49,45.4 70.93,45.96 70.93,46.38 71.49,46.94 v71.49,47.5 | v40.06,54.62 39.57,54.13 34.05,54.13 U2.10 | v41.73,59.37 45.78,63.42 v68.2,63.42
  Bottom 0.127: v67.09,40.16 67.09,41 v71.49,45.4 | v40.06,54.62 40.06,57.35 41.73,59.02 v41.73,59.37 | v68.2,63.42 68.2,63.08 75.82,55.46 75.82,51.83 v71.49,47.5
A3  (via drill 0.2)
  Top 0.127: v63.04,16 63.04,17.88 64.78,19.63 64.78,22.42 IC4.33 | v47.67,8.38 v52.56,13.27
  Bottom 0.127: v63.04,16 60.59,13.55 52.84,13.55 v52.56,13.27 | v47.67,8.38 47.67,4.47 47.04,3.84 10B.1
A3'  (via drill 0.2)  (1 unrouted)
  Top 0.127: v66.04,37.09 66.25,37.3 66.25,38.49 IC4.90 | v71.49,46.17 71.7,46.17 72.68,47.15 73.09,47.15 IC8.15
  Bottom 0.127: v66.04,37.09 66.04,39.47 66.53,39.95 66.53,41.21 v71.49,46.17
A4  (via drill 0.2)
  Top 0.127: v78.4,8.38 78.4,28.15 76.1,30.45 75.33,30.45 IC4.63
  Bottom 0.127: v78.4,8.38 78.4,4.75 77.5,3.84 22B.1
A4'  (via drill 0.2)
  Top 0.127: v66.6,36.53 65.83,36.53 65.48,36.88 65.48,37.3 65.76,37.58 65.76,38.49 IC4.91 | v70.51,42.82 74.21,42.82 74.42,43.03 74.42,47.64 73.58,48.48 73.17,48.48 IC8.16 | v39.29,57 38.59,56.3 38.17,56.3 37.89,56.58 34.05,56.58 U2.8 | v40.27,60.14 40.27,60.91 42.71,63.35 43.13,63.35 v43.69,63.91 | v60.87,49.17 60.87,47.99 60.66,47.78 60.66,46.59 61.01,46.24 61.71,46.24 62.13,46.66 64.22,46.66 64.5,46.94 64.92,46.94 68.48,43.38 68.48,42.4 v69.25,41.63
  Bottom 0.127: v66.6,36.53 67.37,36.53 67.93,37.09 67.93,40.23 69.29,41.6 | v70.51,42.82 69.29,41.6 | v39.29,57 41.03,58.74 41.03,59.37 v40.27,60.14 | v43.69,63.91 55.21,63.91 57.03,62.1 57.03,57.98 56.89,57.84 56.89,50.78 56.96,50.71 56.96,49.59 57.38,49.17 v60.87,49.17 | v69.25,41.63 69.29,41.6
A5  (via drill 0.2)
  Top 0.127: v77.08,8.38 77.56,8.87 77.56,27.45 76.03,28.99 75.33,28.99 IC4.60
  Bottom 0.127: v77.08,8.38 74.98,6.29 74.98,3.84 21B.1
A5'  (via drill 0.2)
  Top 0.127: v65.97,40.16 65.34,39.53 65.34,38.56 IC4.92 | v70.37,45.89 70.37,47.43 72.15,49.21 | 72.15,49.21 72.68,49.73 73.09,49.73 IC8.17 | v19.17,65.66 19.17,63.84 19.73,63.28 21.83,63.28 25.6,59.51 31.88,59.51 32.09,59.3 32.09,57.7 32.51,57.28 32.51,56.44 32.86,56.09 35.17,56.09 35.38,56.3 36.91,56.3 37.19,56.02 39.08,56.02 39.85,56.79 39.85,57.21 39.5,57.56 36.07,57.56 35.8,57.84 34.05,57.84 U2.7 | 72.15,49.21 v71.49,49.87
  Bottom 0.127: v65.97,40.16 65.97,41.49 v70.37,45.89 | v19.17,65.66 19.52,65.66 20.92,67.06 32.3,67.06 33.28,66.08 48.16,66.08 48.44,66.36 64.5,66.36 75.54,55.32 75.54,53.92 v71.49,49.87
A6  (via drill 0.2)
  Top 0.127: v64.57,12.5 64.57,13.06 65.27,13.76 65.27,22.42 IC4.34 | v52.56,9.29 49.56,6.29 49.56,3.84 11A.1
  Bottom 0.127: 20B.1 72.33,3.84 72.33,6.64 66.46,12.5 v64.57,12.5 63.94,11.87 57.24,11.87 54.65,9.29 v52.56,9.29
A6'  (via drill 0.2)
  Top 0.127: v64.71,37.09 64.78,37.16 IC4.93 | v68,53.58 68.28,53.58 70.65,51.2 72.95,51.2 73.09,51.06 IC8.18 | v43.62,57.84 36.21,57.84 34.96,59.09 34.05,59.09 U2.6 | v48.86,52.25 53.33,52.25 54.86,53.78 60.45,53.78 v61.43,52.81
  Bottom 0.127: v64.71,37.09 64.71,37.86 64.99,38.14 64.99,41.49 63.59,42.89 63.59,52.67 63.7,52.77 | 63.7,52.77 64.5,53.58 v68,53.58 | v43.62,57.84 43.62,57.49 v48.86,52.25 | v61.43,52.81 63.67,52.81 63.7,52.77
A7  (via drill 0.2)
  Top 0.127: v73.86,28.08 73.93,28.01 75.26,28.01 IC4.58 | v67.65,14.11 67.65,12.64 v66.6,11.6
  Bottom 0.127: v73.86,28.08 73.86,27.03 72.61,25.77 72.61,21.02 67.65,16.07 v67.65,14.11 | v66.6,11.6 66.95,11.6 69.95,8.59 69.95,3.91 19B.1
A7'  (via drill 0.2)
  Top 0.127: v69.32,40.44 69.04,40.72 65.76,40.72 64.29,39.26 64.29,38.56 IC4.94 | v75.4,47.78 75.4,49.17 74.14,50.43 71.7,50.43 v71.49,50.64 70.16,50.64 64.36,56.44 61.36,56.44 60.59,57.21 60.59,57.77 v56.47,61.89 | v71.49,52.6 72.81,52.6 73.09,52.32 IC8.19 | v36.42,58.4 34.47,60.35 34.05,60.35 U2.5 | v36.7,55.74 42.29,55.74 45.71,59.16 45.71,59.51 45.99,59.79 v48.86,59.79
  Bottom 0.127: v69.32,40.44 72.75,43.87 72.75,45.47 75.05,47.78 v75.4,47.78 | v71.49,52.6 v71.49,50.64 | v36.42,58.4 36.42,56.02 v36.7,55.74 | v48.86,59.79 50.95,61.89 v56.47,61.89
A8  (via drill 0.2)
  Top 0.127: v69.39,8.38 70.79,9.78 74.77,9.78 77.29,12.29 77.29,25.22 76.03,26.47 75.33,26.47 IC4.55
  Bottom 0.127: v69.39,8.38 67.37,6.36 67.37,3.84 18B.1
A8'  (via drill 0.2)
  Top 0.127: v45.92,41.91 44.18,40.16 43.76,40.16 43.06,39.47 43.06,38.7 U1.53 | v44.81,47.36 44.81,47.78 v44.25,48.34 | v43.27,55.81 43.27,56.23 46.13,59.09 47.04,59.09 U2.27 | v63.39,40.02 63.73,39.67 63.73,38.56 IC4.95 | v52.91,40.58 52.14,40.58 v49.77,42.96
  Bottom 0.127: v45.92,41.91 46.27,41.91 46.48,41.7 46.9,41.7 47.25,42.05 47.25,43.66 46.45,44.46 | 46.45,44.46 44.81,46.1 v44.81,47.36 | v44.25,48.34 44.25,50.01 44.53,50.29 44.53,54.55 v43.27,55.81 | v63.39,40.02 61.85,40.02 60.94,40.93 53.26,40.93 v52.91,40.58 | v49.77,42.96 48.93,43.8 48.65,43.8 47.46,44.98 46.97,44.98 46.45,44.46
A9  (via drill 0.2)
  Top 0.127: v67.02,8.52 67.02,9.08 69.04,11.11 70.93,11.11 73.37,13.55 76.31,13.55 77.01,14.25 77.01,24.52 76.1,25.43 75.33,25.43 IC4.53
  Bottom 0.127: v67.02,8.52 64.78,6.29 64.78,3.84 17B.1
A9'  (via drill 0.2)
  Top 0.127: v62.06,40.58 63.25,39.4 63.25,38.56 IC4.96 | v43.9,40.72 42.85,39.67 42.78,39.67 42.57,39.47 42.57,38.7 U1.54 | v51.44,55.04 51.16,54.76 50.46,54.76 50.11,55.11 50.11,55.25 47.53,57.84 47.11,57.84 U2.26
  Bottom 0.127: v62.06,40.58 61.71,40.58 60.8,41.49 57.73,41.49 56.61,42.61 54.31,42.61 | 54.31,42.61 52.14,42.61 50.32,40.79 43.97,40.79 v43.9,40.72 | v51.44,55.04 51.44,54.27 53.68,52.04 53.96,52.04 54.31,51.69 54.31,42.61
A10  (via drill 0.2)
  Top 0.127: v65.34,8.38 65.34,8.73 68.28,11.66 69.39,11.66 71.14,13.41 71.14,14.53 73.23,16.62 73.23,22.42 IC4.50
  Bottom 0.127: v65.34,8.38 64.36,8.38 62.27,6.29 62.27,3.84 16B.1
A10'  (via drill 0.2)
  Top 0.127: 42.67,42.29 42.71,42.33 42.71,43.45 41.59,44.56 41.59,51.97 42.99,53.37 45.16,53.37 45.85,54.06 U2.23 | 42.67,42.29 42.08,41.7 42.08,38.7 U1.55 | v57.87,39.19 60.31,36.74 60.31,35.76 60.1,35.55 59.33,35.55 IC4.3 | v49,41.35 v51.44,38.91 | v44.39,41.35 43.62,41.35 42.67,42.29
  Bottom 0.127: v57.87,39.19 51.72,39.19 v51.44,38.91 | v44.39,41.35 v49,41.35
A11  (via drill 0.2)
  Top 0.127: v66.32,8.94 68.76,11.39 70.79,11.39 73.86,14.46 73.86,23.19 73.58,23.47 71.49,23.47 71.35,23.33 71.35,22.49 IC4.46
  Bottom 0.127: v66.32,8.94 62.34,8.94 59.75,6.36 59.75,3.84 15B.1
A11'  (via drill 0.2)
  Top 0.127: v56.96,36.11 58.08,34.99 59.27,34.99 IC4.4 | v49.35,36.6 47.6,36.6 47.04,37.16 v44.67,37.16 | v43.55,36.67 42.78,36.67 41.59,37.86 41.59,38.63 U1.56 v41.52,40.09 | v43.97,54.2 46.34,56.58 47.04,56.58 U2.25 | v43.48,49.66 42.57,48.76 v42.57,44.35
  Bottom 0.127: v56.96,36.11 54.44,36.11 53.19,37.37 50.11,37.37 v49.35,36.6 | v44.67,37.16 44.04,37.16 v43.55,36.67 | v43.97,54.2 43.97,52.6 44.25,52.32 44.25,50.43 v43.48,49.66 | v42.57,44.35 42.57,41.14 v41.52,40.09
A12  (via drill 0.2)
  Top 0.127: v63.18,9.5 65.69,12.01 65.69,12.92 68.28,15.51 68.28,20.05 69.25,21.02 69.25,22.42 IC4.42
  Bottom 0.127: v63.18,9.5 60.38,9.5 57.17,6.29 57.17,3.84 14B.1
A12'  (via drill 0.2)
  Top 0.127: v57.24,38.56 59.27,36.53 IC4.1 | v49.14,38.35 v50.88,38.35 | v43.55,34.37 43.55,35.41 41.03,37.93 41.03,38.63 U1.57 40.96,38.7 40.96,40.79 40.13,41.63 40.13,43.1 40.68,43.66 40.68,44.08 v40.13,44.63 | v37.89,58.4 37.89,59.02 35.24,61.68 34.05,61.68 U2.4 | v37.05,50.15 37.05,50.5 37.61,51.06 38.03,51.06 39.01,50.08 v39.01,45.75
  Bottom 0.127: v57.24,38.56 54.1,38.56 53.75,38.91 52.21,38.91 51.65,38.35 v50.88,38.35 | v49.14,38.35 48.16,38.35 44.18,34.37 v43.55,34.37 | v37.89,58.4 37.89,57.56 37.54,57.21 37.54,50.99 37.05,50.5 v37.05,50.15 | v40.13,44.63 v39.01,45.75
A13  (via drill 0.2)
  Top 0.127: v68.62,23.89 68.34,23.61 68.34,22.49 IC4.40 | v64.29,18.37 64.29,16.48 61.64,13.83 61.01,13.83 v57.52,10.34
  Bottom 0.127: v68.62,23.89 68.62,22.7 v64.29,18.37 | v57.52,10.34 57.52,9.15 54.65,6.29 54.65,3.84 13B.1
A13'  (via drill 0.2)
  Top 0.127: v38.31,43.03 40.47,40.86 40.47,38.7 U1.58 40.55,38.63 40.55,37.93 42.15,36.32 42.15,34.99 43.55,33.6 v43.55,32.69 | v40.47,58.95 41.38,58.95 41.52,58.81 44.6,58.81 46.13,60.35 47.04,60.35 U2.28 | v63.73,35.9 63.59,35.9 61.85,37.65 61.85,38.49 IC4.99 | v55.56,27.94 53.33,27.94 53.05,28.22 52.98,28.22 v49.97,31.22
  Bottom 0.127: v38.31,43.03 38.03,43.03 37.33,43.73 35.1,43.73 33.49,45.33 33.49,56.23 36.7,59.44 39.99,59.44 v40.47,58.95 | v63.73,35.9 63.73,35.27 63.18,34.72 63.18,29.83 60.73,27.38 56.12,27.38 v55.56,27.94 | v49.97,31.22 46.97,31.22 44.88,33.32 44.18,33.32 v43.55,32.69
A14  (via drill 0.2)
  Top 0.127: v65.83,16.97 66.74,17.88 66.74,22.42 IC4.37 | v56.61,10.34 v60.38,14.11
  Bottom 0.127: v65.83,16.97 63.25,16.97 v60.38,14.11 | v56.61,10.34 56.12,10.34 52.07,6.29 12B.1
A14'  (via drill 0.2)
  Top 0.127: v67.93,35.9 65.27,33.25 62.55,33.25 60.8,31.5 59.33,31.5 IC4.11 | v33.49,66.64 32.65,65.8 32.65,64.54 | 32.65,64.54 32.65,63.91 33.56,63.01 33.98,63.01 U2.3 | v35.38,40.58 35.66,40.86 38.94,40.86 39.99,39.81 39.99,38.7 U1.59 | v29.23,63.98 29.79,64.54 32.65,64.54
  Bottom 0.127: v67.93,35.9 67.93,36.67 68.2,36.95 68.2,40.09 69.18,41.07 69.53,41.07 72.47,44.01 72.47,45.61 76.24,49.38 76.73,49.38 77.08,49.73 77.08,55.11 68.76,63.42 68.76,63.63 65.76,66.64 v33.49,66.64 | v35.38,40.58 35.38,41.91 31.26,46.03 31.26,61.96 v29.23,63.98
A15  (via drill 0.2)
  Top 0.127: v65.83,21.09 65.83,22.42 IC4.35 | v61.22,18.86 61.22,21.3 60.73,21.79 60.73,22.14 60.38,22.49 59.96,22.49 57.8,20.33 57.8,19.28 48.44,9.92 48.44,9.57 47.95,9.08 46.9,9.08 v46.69,9.29
  Bottom 0.127: v65.83,21.09 63.59,18.86 v61.22,18.86 | v46.69,9.29 46.69,9.78 47.39,10.48 47.81,10.48 49.49,8.8 49.49,3.84 11B.1
A15'  (via drill 0.2)
  Top 0.127: v43.55,31.92 41.87,33.6 41.87,35.2 v39.78,37.3 39.57,37.51 39.57,38.63 U1.60 | v54.52,31.43 v53.47,30.39 | v57.31,33.74 58.29,33.74 58.5,33.95 59.27,33.95 IC4.6 | v39.15,58.4 40.27,59.51 40.47,59.51 45.16,64.19 47.04,64.19 U2.31 | v37.82,50.5 37.82,48.34 37.89,48.27 v37.89,44.63 | v39.78,40.79 v38.8,41.77
  Bottom 0.127: v43.55,31.92 45.08,31.92 47.32,29.69 52.77,29.69 v53.47,30.39 | v54.52,31.43 55,31.43 v57.31,33.74 | v39.15,58.4 37.82,57.07 v37.82,50.5 | v37.89,44.63 37.89,44.22 38.87,43.24 38.87,41.84 v38.8,41.77 | v39.78,37.3 v39.78,40.79
A16'  (via drill 0.2)
  Top 0.127: v37.47,24.73 37.47,22.7 U1.12 | v36.14,36.11 36.14,36.67 v35.52,37.3 | v35.66,62.38 35.66,63.01 34.47,64.19 34.05,64.19 U2.2 | v57.52,42.82 56.4,41.7 56.4,33.88 57.1,33.18 57.52,33.18 57.8,33.46 59.27,33.46 IC4.7
  Bottom 0.127: v37.47,24.73 37.47,26.26 36.49,27.24 36.49,31.5 36.14,31.85 v36.14,36.11 | v35.52,37.3 35.52,39.95 35.94,40.37 35.94,41.77 31.74,45.96 31.74,58.46 v35.66,62.38 35.66,62.31 44.04,62.31 50.32,56.02 51.23,56.02 56.68,50.57 56.68,49.45 57.52,48.62 60.94,48.62 61.78,47.78 61.78,46.59 58.01,42.82 v57.52,42.82
A17'  (via drill 0.2)
  Top 0.127: v53.75,33.46 54.31,32.9 57.66,32.9 57.73,32.97 59.27,32.97 IC4.8 | 50.53,33.46 50.39,33.46 50.18,33.25 47.18,33.25 46.76,33.67 46.06,33.67 U1.44 | v45.3,60.28 45.3,61.61 46.62,62.94 47.04,62.94 U2.30 | v50.25,45.19 50.25,44.63 49.14,43.52 48.79,43.52 47.53,42.26 47.53,39.19 50.53,36.18 50.53,33.46 | 50.53,33.46 v50.74,33.46
  Bottom 0.127: v50.74,33.46 v53.75,33.46 | v45.3,60.28 45.3,56.58 49.49,52.39 49.49,45.96 v50.25,45.19
A18'  (via drill 0.2)
  Top 0.127: v53.89,32.55 59.27,32.55 IC4.9 | v51.3,32.9 47.04,32.9 46.76,33.18 46.06,33.18 U1.43 | v42.92,63.91 41.38,65.45 34.05,65.45 U2.1 | v48.86,58.67 48.86,58.33 51.58,55.6 v59.89,55.6 | v61.15,54.34 64.15,54.34 65.27,53.23 v65.27,51.69 | v65.27,41.98 65.27,41.14 v64.15,40.02
  Bottom 0.127: v51.3,32.9 51.65,32.55 v53.89,32.55 55.91,34.58 57.66,34.58 58.29,33.95 61.43,33.95 62.34,34.85 62.34,36.32 64.15,38.14 v64.15,40.02 | v42.92,63.91 43.76,63.08 44.46,63.08 v48.86,58.67 | v61.15,54.34 v59.89,55.6 | v65.27,51.69 65.27,50.64 63.88,49.24 63.88,43.38 v65.27,41.98
ALE  (via drill 0.2)
  Top 0.127: v52,54.48 50.32,54.48 50.25,54.55 45.85,54.55 44.94,53.65 42.85,53.65 41.31,52.11 41.31,47.29 34.54,40.51 U1.70 | v61.22,47.57 61.78,47.57 61.99,47.78 64.29,47.78 64.5,47.57 66.04,47.57 69.46,44.15 69.46,42.68 71.63,40.51 72.61,40.51 73.09,41 73.09,42.12 IC8.11
  Bottom 0.127: v52,54.48 56.4,50.08 56.4,49.31 58.15,47.57 v61.22,47.57
AREF  (via drill 0.2)
  Top 0.127: v21.55,25.29 18.05,21.79 18.05,21.16 C6.1 | v28.67,25.5 29.09,25.5 29.23,25.64 30,25.64 U1.98
  Bottom 0.127: v21.55,25.29 28.46,25.29 v28.67,25.5
B0  (via drill 0.2)
  Top 0.127: v26.58,27.1 27.48,26.19 30,26.19 U1.97 | v17.15,45.47 16.31,46.31 16.31,46.45 15.47,47.29 15.05,47.29 IC9.12
  Bottom 0.127: v26.58,27.1 26.58,29.27 26.65,29.34 26.65,30.32 17.15,39.81 v17.15,45.47
B1  (via drill 0.2)
  Top 0.127: v27.34,27.1 27.9,26.54 28.88,26.54 29.02,26.68 30,26.68 U1.96 | v17.91,45.47 17.91,45.82 16.31,47.43 16.31,47.78 15.47,48.62 15.05,48.62 IC9.13
  Bottom 0.127: v27.34,27.1 27.34,30.04 17.91,39.47 v17.91,45.47
B2  (via drill 0.2)
  Top 0.127: v28.67,27.1 28.74,27.17 30,27.17 U1.95 | v26.99,35.55 v26.99,32.27 | v20.08,44.08 16.59,47.57 16.59,48.76 15.47,49.87 15.05,49.87 IC9.14
  Bottom 0.127: v28.67,27.1 28.67,29.83 26.99,31.5 v26.99,32.27 | v26.99,35.55 26.99,37.16 23.36,40.79 23.36,41.91 21.2,44.08 v20.08,44.08
B3
  Top 0.127: U1.94 30,27.66 24.76,27.66 23.29,26.19 14.63,26.19 13.37,27.45 13.37,28.64 10.72,31.29 10.72,47.64 12.47,49.38 12.47,49.87 13.72,51.13 14.98,51.13 IC9.15
B4  (via drill 0.2)
  Top 0.127: v11.28,31.5 13.65,29.13 13.65,27.59 14.77,26.47 23.15,26.47 24.83,28.15 30,28.15 U1.93 | v10.16,44.56 10.16,47.5 12.19,49.52 12.19,50.01 14.56,52.39 14.98,52.39 IC9.16
  Bottom 0.127: v11.28,31.5 11.28,43.45 v10.16,44.56
B5  (via drill 0.2)
  Top 0.127: v24.27,29.69 24.27,28.85 24.62,28.5 25.04,28.5 25.18,28.64 30,28.64 U1.92 | v14.14,43.94 13.02,45.05 v13.02,49.66 | v13.02,52.11 14.56,53.65 14.98,53.65 IC9.17
  Bottom 0.127: v24.27,29.69 24.27,32.27 16.31,40.23 16.31,41.77 v14.14,43.94 | v13.02,52.11 v13.02,49.66
B6  (via drill 0.2)
  Top 0.127: IC9.18 15.75,54.24 16.13,54.24 16.17,54.2 16.31,54.06 16.31,50.78 16.1,50.57 14,50.57 13.58,50.15 v13.58,45.26 | v24.83,29.06 24.9,28.99 28.04,28.99 28.18,29.13 30,29.13 U1.91
  Bottom 0.127: v24.83,29.06 24.13,29.06 16.03,37.16 16.03,41.28 13.58,43.73 v13.58,45.26
B7  (via drill 0.2)
  Top 0.127: v27.9,29.62 30,29.62 U1.90 | v8.13,28.15 v10.44,25.84 | v8.48,46.24 11.91,49.66 11.91,53.51 14.63,56.23 14.98,56.23 IC9.19
  Bottom 0.127: v27.9,29.62 27.9,26.89 26.85,25.84 v10.44,25.84 | v8.13,28.15 8.13,45.89 v8.48,46.24
CFG_CLK  (1 unrouted)
CFG_DATA  (1 unrouted)
CFG_RESET  (1 unrouted)
CS_LLS
  Top 0.127: MICRO_SD1.2 12.81,32.83 13.51,32.83 14.91,31.43 18.12,31.43 20.78,28.78 20.78,27.87 21.55,27.1 21.97,27.1 IC6.8
CTRL_CLK  (via drill 0.2)
  Top 0.127: v37.54,40.3 U1.64 | v37.54,42.75 37.54,43.03 38.38,43.87 v40.13,43.87 | v49.07,44.63 v46.69,42.26 | v51.3,44.35 51.65,44.35 52.07,43.94 v54.93,43.94 | v57.52,43.66 58.84,43.66 59.12,43.38 IC3.9
  Bottom 0.127: v37.54,42.75 v37.54,40.3 | v40.13,43.87 41.31,43.87 42.36,44.91 44.04,44.91 v46.69,42.26 | v49.07,44.63 49.56,44.63 49.83,44.35 v51.3,44.35 | v54.93,43.94 57.24,43.94 v57.52,43.66
D0  (via drill 0.2)
  Top 0.127: 32.65,52.74 32.65,51.2 33.56,50.29 33.98,50.29 U2.13 | 32.65,52.74 32.65,53.65 31.33,54.97 30.91,54.97 IC5.12 | v49.83,28.15 49.83,28.08 52.42,25.5 55.63,25.5 56.47,26.33 56.82,26.33 58.43,27.94 59.27,27.94 IC4.18 | 31.05,35.83 30.91,35.83 30.77,35.69 30.07,35.69 U1.78 | 31.05,35.83 32.58,35.83 37.26,31.15 v38.52,31.15 41.1,28.57 41.1,27.59 47.74,20.95 47.74,20.54 47.39,20.19 v45.57,20.19 | v7.09,47.99 6.46,47.36 4.99,47.36 IC9.9 | v29.09,39.33 29.09,38.98 31.05,37.02 31.05,35.83 | v59.33,39.74 61.43,41.84 61.43,42.19 62.62,43.38 63.04,43.38 IC8.9 | v48.79,31.78 48.79,31.64 52.77,27.66 v52.84,27.66 | v28.25,52.74 32.65,52.74 | v28.25,49.38 28.25,48.48 v27.41,47.64 | v31.81,8.8 31.81,3.84 4A.1
  Bottom 0.127: v38.52,31.15 41.31,31.15 44.32,28.15 v49.83,28.15 50.32,27.66 v52.84,27.66 | v7.09,47.99 8.69,47.99 9.18,48.48 12.6,48.48 13.16,47.92 19.38,47.92 23.54,43.76 | 23.54,43.76 27.97,39.33 v29.09,39.33 | v59.33,39.74 51.86,39.74 51.58,39.47 51.23,39.47 49.97,38.21 49.97,38 48.79,36.81 v48.79,31.78 | v28.25,49.38 v28.25,52.74 | 23.54,43.76 v27.41,47.64 | v31.81,8.8 31.81,9.29 35.66,13.13 38.87,13.13 45.57,19.84 v45.57,20.19
D1  (via drill 0.2)
  Top 0.127: 26.68,55.01 26.65,54.97 26.65,53.58 31.19,49.03 33.98,49.03 U2.14 | 26.68,55.01 27.97,56.3 30.84,56.3 IC5.13 | v28.11,38 28.11,37.37 29.23,36.25 30,36.25 U1.77 | IC9.8 4.99,48.62 v6.6,48.62 7.23,48.62 7.92,47.92 7.92,42.82 10.44,40.3 10.44,30.66 13.09,28.01 13.09,27.31 v17.56,22.84 | v25.6,55.25 25.81,55.04 26.65,55.04 26.68,55.01 | v61.08,28.5 60.56,27.98 | 60.56,27.98 60.1,27.52 59.33,27.52 IC4.19 | v66.04,43.87 65.69,43.87 64.92,44.63 63.11,44.63 IC8.8 | v34.33,8.38 34.33,3.84 5A.1 | v36.21,8.38 v39.57,11.73 39.85,12.01 39.85,13.48 38.87,14.46 v37.19,14.46 | 60.56,27.98 v63.18,25.36
  Bottom 0.127: v28.11,38 19.03,47.08 9.25,47.08 8.9,47.43 6.88,47.43 6.53,47.78 6.53,48.55 v6.6,48.62 6.6,50.15 11.7,55.25 v25.6,55.25 | v61.08,28.5 61.08,29.48 62.9,31.29 62.9,35.83 63.59,36.53 64.92,36.53 65.41,37.02 65.41,41.35 66.04,41.98 v66.04,43.87 | v36.21,8.38 v34.33,8.38 | v39.57,11.73 41.8,11.73 51.16,21.09 60.1,21.09 60.66,21.65 64.78,21.65 66.81,23.68 66.81,24.1 65.55,25.36 v63.18,25.36 | v17.56,22.84 26.71,22.84 29.02,20.54 29.02,18.51 31.39,16.14 35.52,16.14 v37.19,14.46
D2  (via drill 0.2)
  Top 0.127: v56.68,25.77 57.87,26.96 59.27,26.96 IC4.20 | v41.38,33.32 41.38,34.92 v40.82,35.48 | v37.12,44.7 37.12,45.05 34.92,47.25 | 34.92,47.25 34.47,47.71 34.05,47.71 U2.15 | v64.71,46.38 64.29,45.96 63.11,45.96 IC8.7 | v64.71,48.55 64.08,49.17 61.99,49.17 60.59,50.57 60.59,50.92 60.03,51.48 v53.75,51.48 | v49.83,41.35 50.04,41.35 v51.37,40.02 | v25.11,47.99 27.83,45.26 27.83,39.81 30,37.65 30,36.74 U1.76 | v28.67,57.56 30.84,57.56 IC5.14 | v8.97,51.76 3.87,51.76 3.66,51.55 3.66,50.78 4.5,49.94 4.92,49.94 IC9.7 4.29,50.08 3.38,49.17 3.38,45.54 3.66,45.26 v3.66,44.91 | v17.49,13.34 18.12,12.71 23.15,12.71 26.51,9.36 34.12,9.36 36.77,6.71 36.77,3.84 6A.1 | v35.72,48.06 34.92,47.25 | v35.72,54.69 32.86,54.69 31.81,55.74 v28.18,55.74
  Bottom 0.127: v56.68,25.77 55.77,25.77 53.89,27.66 53.89,29.27 53.54,29.62 53.12,29.62 52.91,29.41 45.3,29.41 42.4,32.31 | v41.38,33.32 42.4,32.31 | v40.82,35.48 40.82,42.26 41.24,42.68 41.24,43.1 40.89,43.45 40.47,43.45 40.33,43.31 39.92,43.31 38.45,44.77 38.45,44.84 38.1,45.19 37.61,45.19 v37.12,44.7 | v64.71,48.55 v64.71,46.38 | v53.75,51.48 53.75,44.63 50.46,41.35 v49.83,41.35 | v51.37,40.02 49.69,38.35 49.69,38.14 45.16,33.6 43.69,33.6 42.4,32.31 | v25.11,47.99 25.11,51.13 24.97,51.27 24.97,52.67 | 24.97,52.67 24.97,53.85 27.52,56.4 | v28.67,57.56 27.52,56.4 | v8.97,51.76 9.88,52.67 24.97,52.67 | v17.49,13.34 9.04,13.34 6.67,10.97 6.25,10.97 5.27,11.94 5.27,15.51 3.52,17.25 3.52,30.39 3.66,30.52 v3.66,44.91 | v35.72,54.69 v35.72,48.06 | 27.52,56.4 v28.18,55.74
D3  (via drill 0.2)
  Top 0.127: v59.61,14.11 62.76,17.25 62.76,22.42 IC4.29 | v44.53,8.38 44.53,3.91 44.46,3.84 9A.1 | v61.22,46.8 61.57,47.15 63.04,47.15 IC8.6 | v55.98,46.66 54.23,46.66 54.03,46.45 51.44,46.45 v51.37,46.38 | v50.04,47.29 48.3,47.29 47.46,46.45 47.11,46.45 U2.17 47.04,46.38 v43.9,46.38 | 26.65,49.94 26.65,53.16 25.04,54.76 25.04,55.46 28.39,58.81 30.84,58.81 IC5.15 | 26.65,49.94 26.65,48.55 | 26.65,48.55 26.65,47.64 27.2,47.08 27.48,47.08 32.02,42.54 U1.75 | v9.95,51.13 6.25,51.13 | 6.25,51.13 4.99,51.13 IC9.6 | 26.65,48.55 v24.55,48.55 | v34.05,45.54 32.86,45.54 28.46,49.94 26.65,49.94 | v36.77,11.73 36.77,12.08 35.52,13.34 35.52,14.74 v34.68,15.58 | v9.67,28.15 9.67,29.2 9.04,29.83 9.04,40.58 4.15,45.47 3.87,45.47 3.66,45.68 3.66,49.03 3.94,49.31 6.11,49.31 6.25,49.45 6.25,51.13
  Bottom 0.127: v59.61,14.11 50.25,14.11 v44.53,8.38 44.53,8.77 43.5,9.8 43.5,9.82 39.32,9.82 37.4,11.73 v36.77,11.73 | v61.22,46.8 56.12,46.8 v55.98,46.66 | v51.37,46.38 50.95,46.38 v50.04,47.29 | v9.95,51.13 10.37,51.13 12.95,48.55 v24.55,48.55 | v43.9,46.38 38.03,46.38 35.66,44.01 35.24,44.01 34.05,45.19 v34.05,45.54 | v34.68,15.58 30.98,15.58 25.81,20.75 23.08,20.75 19.87,17.53 14.63,17.53 12.95,19.21 11,19.21 8.83,21.37 8.83,27.31 v9.67,28.15
D4  (via drill 0.2)
  Top 0.127: v63.32,19.42 64.22,20.33 64.22,22.42 IC4.32 | v45.64,10.27 45.64,5.17 46.97,3.84 10A.1 | v66.39,49.45 64.92,47.99 64.5,47.99 64.01,48.48 63.11,48.48 IC8.5 | v66.39,52.46 65.55,53.3 65.55,53.37 64.01,54.9 53.19,54.9 51.65,53.37 45.57,53.37 44.32,52.11 v43.69,52.11 | v43.48,48.9 45.43,48.9 46.55,47.78 47.04,47.78 U2.18 | 32.51,40.09 32.51,43.24 28.81,46.94 v28.81,48.83 | 32.51,40.09 32.51,38.7 U1.74 | v28.95,60.07 30.84,60.07 IC5.16 | v7.51,57.77 7.16,58.12 3.87,58.12 3.66,57.91 3.66,53.3 4.5,52.46 4.92,52.46 IC9.5 | v37.33,48.06 37.33,48.9 36.84,49.38 35.31,49.38 35.24,49.45 31.53,49.45 v28.81,52.18 | v50.67,18.44 41.38,27.73 41.38,30.18 36,35.55 35.94,35.55 34.75,36.74 v34.75,37.3 | 32.51,40.09 v32.65,40.09
  Bottom 0.127: v63.32,19.42 51.79,19.42 50.71,18.34 | 50.71,18.34 45.64,13.27 v45.64,10.27 | v66.39,52.46 v66.39,49.45 | v43.69,52.11 43.69,50.64 42.92,49.87 42.92,49.8 | 42.92,49.8 42.92,49.45 v43.48,48.9 | v28.81,48.83 v28.81,52.18 28.81,56.93 29.23,57.35 29.23,59.79 v28.95,60.07 26.92,62.1 13.02,62.1 8.69,57.77 v7.51,57.77 | 42.92,49.8 39.08,49.8 v37.33,48.06 | v50.67,18.44 50.67,18.37 50.71,18.34 | v34.75,37.3 34.75,38 v32.65,40.09
D5  (via drill 0.2)
  Top 0.127: v30.77,38.07 31.12,37.72 32.79,37.72 33,37.93 33,38.63 U1.73 | v6.88,52.32 6.74,52.32 5.41,53.65 4.99,53.65 IC9.4 | v25.88,60.07 27.13,61.33 30.84,61.33 IC5.17 30.91,61.33 31.33,61.33 32.65,60 32.65,57.56 33.07,57.14 38.1,57.14 v38.38,56.86 | v64.71,49.31 64.29,49.73 63.11,49.73 IC8.4 | v64.71,45.61 64.43,45.61 64.15,45.33 61.43,45.33 60.17,46.59 57.87,46.59 v56.68,47.78 | v54.86,49.59 54.17,50.29 49.83,50.29 48.82,49.28 | 48.82,49.28 48.58,49.03 47.11,49.03 U2.19 | 59.27,24.24 59.27,23.61 57.52,21.86 57.52,19.42 48.16,10.06 48.16,9.71 47.81,9.36 47.39,9.36 45.92,10.83 45.43,10.83 41.94,7.33 41.94,3.84 8A.1 | 59.27,24.24 59.27,24.45 IC4.25 | v55.42,45.26 55.42,44.22 55.49,44.15 55.49,39.53 51.09,35.13 v51.09,34.99 | 59.27,24.24 v57.87,24.24 | v42.15,51.76 43.13,50.78 48.44,50.78 v48.79,50.43 | v48.79,49.31 48.82,49.28
  Bottom 0.127: v30.77,38.07 28.95,38.07 28.32,37.44 27.9,37.44 24.48,40.86 24.48,41.21 18.89,46.8 9.11,46.8 8.76,47.15 6.74,47.15 6.04,47.85 6.04,51.48 v6.88,52.32 10.09,55.53 21.34,55.53 v25.88,60.07 | v64.71,49.31 64.15,48.76 64.15,46.17 v64.71,45.61 | v54.86,49.59 v56.68,47.78 56.47,47.92 55.42,46.87 v55.42,45.26 | v51.09,34.99 50.39,34.99 49.42,34.02 49.42,33.6 52.07,30.94 53.68,30.94 55,29.62 55,26.96 55.63,26.33 56.89,26.33 57.87,25.36 v57.87,24.24 | v38.38,56.86 38.38,55.53 v42.15,51.76 | v48.79,49.31 v48.79,50.43
D6  (via drill 0.2)
  Top 0.127: v7.3,55.95 6.32,54.97 4.99,54.97 IC9.3 | v25.88,60.84 26.23,60.84 27.83,62.45 30.63,62.45 30.84,62.66 IC5.18 30.91,62.66 31.33,62.66 33.07,60.91 35.24,60.91 v37.26,58.88 | v35.45,44.56 33.56,42.68 33.56,38.7 U1.72 33.56,38.63 33.56,37.51 40.19,30.87 v40.19,30.59 | v42.29,49.24 43.27,50.22 47.04,50.22 U2.20 47.11,50.22 47.46,49.87 49,49.87 49.69,50.57 53.61,50.57 54.23,51.2 59.54,51.2 v60.03,50.71 | v54.52,24.94 56.61,24.94 57.1,25.43 59.27,25.43 IC4.23 | v61.22,50.71 61.5,50.99 63.04,50.99 IC8.3 | v42.15,13.55 39.43,10.83 39.43,3.84 7A.1
  Bottom 0.127: v7.3,55.95 12.19,60.84 v25.88,60.84 | v35.45,44.56 35.8,44.56 37.92,46.7 | 37.92,46.7 40.47,49.24 v42.29,49.24 | 53.43,26.02 52.07,27.38 44.67,27.38 41.45,30.59 v40.19,30.59 | 53.43,26.02 v54.52,24.94 | v60.03,50.71 v61.22,50.71 | v42.15,13.55 42.15,16 46.62,20.47 46.62,20.95 51.16,25.5 52.91,25.5 53.43,26.02 | v37.26,58.88 37.26,51.13 36.21,50.08 36.21,48.41 37.92,46.7
D7  (via drill 0.2)
  Top 0.127: v66.22,31.95 63.32,29.06 59.33,29.06 IC4.16 | v74.98,46.94 74.98,47.43 74.77,47.64 v74.77,48.69 | v68.62,47.71 68.62,48.41 65.9,51.13 65.06,51.13 63.94,52.25 63.11,52.25 IC8.2 63.04,52.25 61.22,52.25 59.96,53.51 55,53.51 53.05,51.55 47.11,51.55 U2.21 47.04,51.55 v43.13,51.55 | v60.87,42.05 59.19,42.05 IC3.8 | v63.73,41.14 64.15,41.56 64.22,41.56 64.71,42.05 64.71,42.19 65.41,42.89 v65.48,42.89 | v34.12,42.4 34.05,42.33 34.05,38.7 U1.71 | v29.23,63.01 29.51,63.01 30.42,63.91 30.84,63.91 IC5.19 | v6.6,56.72 6.18,56.3 4.99,56.3 IC9.2 | v22.8,3.84 24.13,3.84 1A.1 | v18.68,7.96 18.68,9.22 16.24,11.66 v16.24,18.09 | v5.2,28.85 v9.39,24.66 | v36.77,48.69 35.38,48.69 35.17,48.48 v30.7,48.48
  Bottom 0.127: v74.98,46.94 73.03,44.98 73.03,43.73 71.84,42.54 71.84,40.3 68.85,37.31 68.85,35.6 68.05,34.81 67.53,34.81 66.57,33.84 66.57,32.31 v66.22,31.95 | v74.77,48.69 73.44,48.69 71.7,46.94 69.39,46.94 68.87,47.46 | v68.62,47.71 68.87,47.46 | v60.87,42.05 62.83,42.05 v63.73,41.14 | v65.48,42.89 65.48,44.08 68.87,47.46 | v34.12,42.4 34.12,42.75 30.49,46.38 30.49,48.48 | 30.49,48.48 30.49,61.75 v29.23,63.01 28.11,64.12 13.09,64.12 6.6,57.63 v6.6,56.72 5.2,55.32 v5.2,28.85 | v18.68,7.96 v22.8,3.84 | v16.24,18.09 14.49,18.09 13.09,19.49 11.14,19.49 9.39,21.23 v9.39,24.66 | v43.13,51.55 42.71,51.55 41.24,50.08 38.17,50.08 v36.77,48.69 | 30.49,48.48 v30.7,48.48
DI_LLS
  Top 0.127: MICRO_SD1.3 12.81,33.95 13.23,33.95 14.98,32.2 15.82,32.2 IC6.3
DO_LLC
  Top 0.127: R20.1 21.13,39.88 21.13,39.53 22.66,38 22.66,35.76 23.29,35.13 23.29,32.97 22.52,32.2 22.03,32.2 IC6.12
DOWN  (1 unrouted)
EN_M1_NOT  (1 unrouted)
FIRE  (via drill 0.2)
  Top 0.127: v76.52,49.94 76.52,39.12 74.28,36.88 74.28,34.23 74.49,34.02 75.26,34.02 IC4.70 | v75.33,50.5 74.14,51.69 71.63,51.69 70.51,52.81 70.51,55.74 69.81,56.44 69.11,56.44 68.76,56.79 68.76,60.42 J2.6
  Bottom 0.127: v76.52,49.94 75.89,49.94 v75.33,50.5
GET_CTRL_REG  (via drill 0.2)
  Top 0.127: v49.35,34.72 46.06,34.72 U1.46 | v61.78,35.06 64.85,35.06 65.13,34.78 65.62,34.78 68.28,37.44 IC4.86
  Bottom 0.127: v49.35,34.72 49.69,34.72 50.53,35.55 61.29,35.55 v61.78,35.06
GET_DATA_REG  (via drill 0.2)
  Top 0.127: v49.97,33.81 49.62,34.16 46.06,34.16 U1.45 | v62.06,33.53 64.78,33.53 68.76,37.51 68.76,38.49 IC4.85
  Bottom 0.127: v49.97,33.81 49.97,33.46 52.21,31.22 53.96,31.22 54.31,30.87 59.4,30.87 v62.06,33.53
GND  (via drill 0.2)
  Top 0.3: J1.5 4.43,13.9 4.43,12.85 J1.S4 4.57,12.78 7.16,12.78 7.3,12.64 C20.1 7.44,12.5 7.44,10.48 C21.1 7.44,10.27 7.44,8.03 JP6.6 7.58,7.96 10.44,5.1 14,5.1 IC1.3 | v9.18,16.2 10.44,16.2 C8.1 | 1.71,17.67 1.71,18.79 J1.S6 1.85,18.93 2.27,19.35 2.27,23.61 | 1.71,17.67 1.71,16.14 J1.S2 1.71,16 1.71,14.46 J1.S1 1.78,14.32 1.78,11.66 J1.S3 | 2.27,23.61 2.27,26.12 MICRO_SD1.MP3 2.41,26.26 3.8,27.66 3.8,39.67 2.34,41.14 2.34,41.98 MICRO_SD1.MP2 | 1.71,17.67 4.36,17.67 J1.S5 | C17.1 25.67,15.58 24.9,15.58 23.01,17.46 22.73,17.46 R26.2 22.66,17.6 v20.92,19.35 | C17.1 25.74,15.44 25.74,13.48 C16.1 25.88,13.41 28.18,11.11 33.21,11.11 | 33.21,11.11 37.05,11.11 38.8,12.85 39.01,12.85 C14.2 | C5.1 28.81,17.6 28.81,17.74 28.04,18.51 26.78,18.51 26.58,18.3 26.58,16.55 25.74,15.72 C17.1 | v33.21,9.92 33.21,11.11 | 17.22,30.11 17.22,27.87 16.45,27.1 15.89,27.1 IC6.7 | 17.22,30.11 16.52,30.8 15.89,30.8 IC6.4 | C13.2 24.83,33.39 24.83,31.85 22.59,29.62 22.03,29.62 IC6.10 21.9,29.69 21.41,29.69 20.71,30.39 | 20.71,30.39 20.71,32.62 21.48,33.39 21.97,33.39 IC6.13 | v18.61,30.18 17.35,30.18 17.22,30.11 | v20.36,30.18 20.57,30.39 20.71,30.39 | v17.56,34.23 17.15,34.65 16.03,34.65 IC6.1 15.82,34.72 13.3,37.23 12.81,37.23 MICRO_SD1.6 12.67,37.37 12.33,37.37 11.77,37.93 11.77,41 11.98,41.21 11.98,41.98 MICRO_SD1.MP1 12.12,42.05 20.92,42.05 v23.64,44.77 | 14.49,20.33 18.75,20.33 19.52,21.09 19.73,21.09 C6.2 19.87,21.16 v20.92,21.16 | 14.49,20.33 13.86,19.7 IC7.1 | 12.05,23.47 12.05,22.84 14.42,20.47 14.49,20.33 | 12.05,23.47 12.05,26.89 MICRO_SD1.MP4 11.91,27.03 11.91,27.52 11.38,28.05
  Top 0.3: 11.38,28.05 10.02,29.41 10.02,40.16 4.99,45.19 4.99,46.03 IC9.10 | 11.38,28.05 v11.84,28.5 | 2.27,23.61 10.23,23.61 10.37,23.47 12.05,23.47 | 62.93,24.2 63.81,23.33 63.81,22.49 IC4.31 | 62.93,24.2 60.66,26.47 59.33,26.47 IC4.21 | 73.86,29.97 73.44,29.97 71.77,28.29 68.76,28.29 68,29.06 v67.31,29.06 65.41,29.06 63.81,27.45 63.81,25.08 62.93,24.2 | 73.86,29.97 75.26,29.97 IC4.62 | 76.83,36.64 77.78,37.58 77.78,39.95 79.59,41.77 79.59,43.24 R10.1 79.59,43.38 79.59,46.03 R9.1 79.8,46.1 80.99,46.1 R8.1 81.06,46.24 82.17,47.36 82.17,49.45 S1.1 82.04,49.52 81.06,49.52 76.94,53.65 76.94,53.99 75.68,55.25 v74.7,55.25 | 76.83,36.64 76.73,36.53 75.33,36.53 IC4.75 | v73.3,15.23 72.12,14.04 C18.2 | IC2.1 75.47,17.18 74.42,18.23 v74.42,18.51 74.56,18.58 75.05,19.07 75.05,20.95 74.7,21.3 v74.7,23.68 | v73.58,25.98 71.49,25.98 71.14,25.64 71.14,24.24 70.3,23.4 70.3,22.49 IC4.44 | v77.43,36.04 76.83,36.64 | v73.86,29.76 73.86,29.97 | 35.03,25.22 35.38,25.22 37.05,23.54 37.05,22.7 U1.11 | 35.03,25.22 31.39,25.22 | 31.39,25.22 30.07,25.22 U1.99 | v27.97,31.29 27.97,32.97 29.16,34.16 30,34.16 U1.81 | 31.39,25.22 v31.39,28.01 | v40.68,42.89 41.87,42.89 C2.2 | v38.94,40.09 38.94,39.95 38.52,39.53 U1.62 | v39.15,34.65 41.8,31.99 41.8,28.57 42.71,27.66 45.99,27.66 U1.32 | 35.2,45.72 36.07,44.84 v36.07,42.82 | 35.2,45.72 34.54,46.38 34.05,46.38 U2.16 | 35.03,25.22 35.03,28.78 36.28,30.04 v37.33,30.04 | 12.05,60.07 12.05,61.61 10.89,62.76 | 12.05,60.07 12.05,59.02 C1.2 | 10.89,62.76 9.04,64.61 8.34,64.61 LED3.P1 8.34,64.75 8.34,65.66 LED3.P2 8.34,65.87 8.34,66.78 LED3.P3 | v21.13,66.5 21.55,66.92 28.53,66.92 C3.2